# Altium schematic sheet Bluetooth.SchDoc
size A4; SheetNumber: 6; SheetTotal: 10
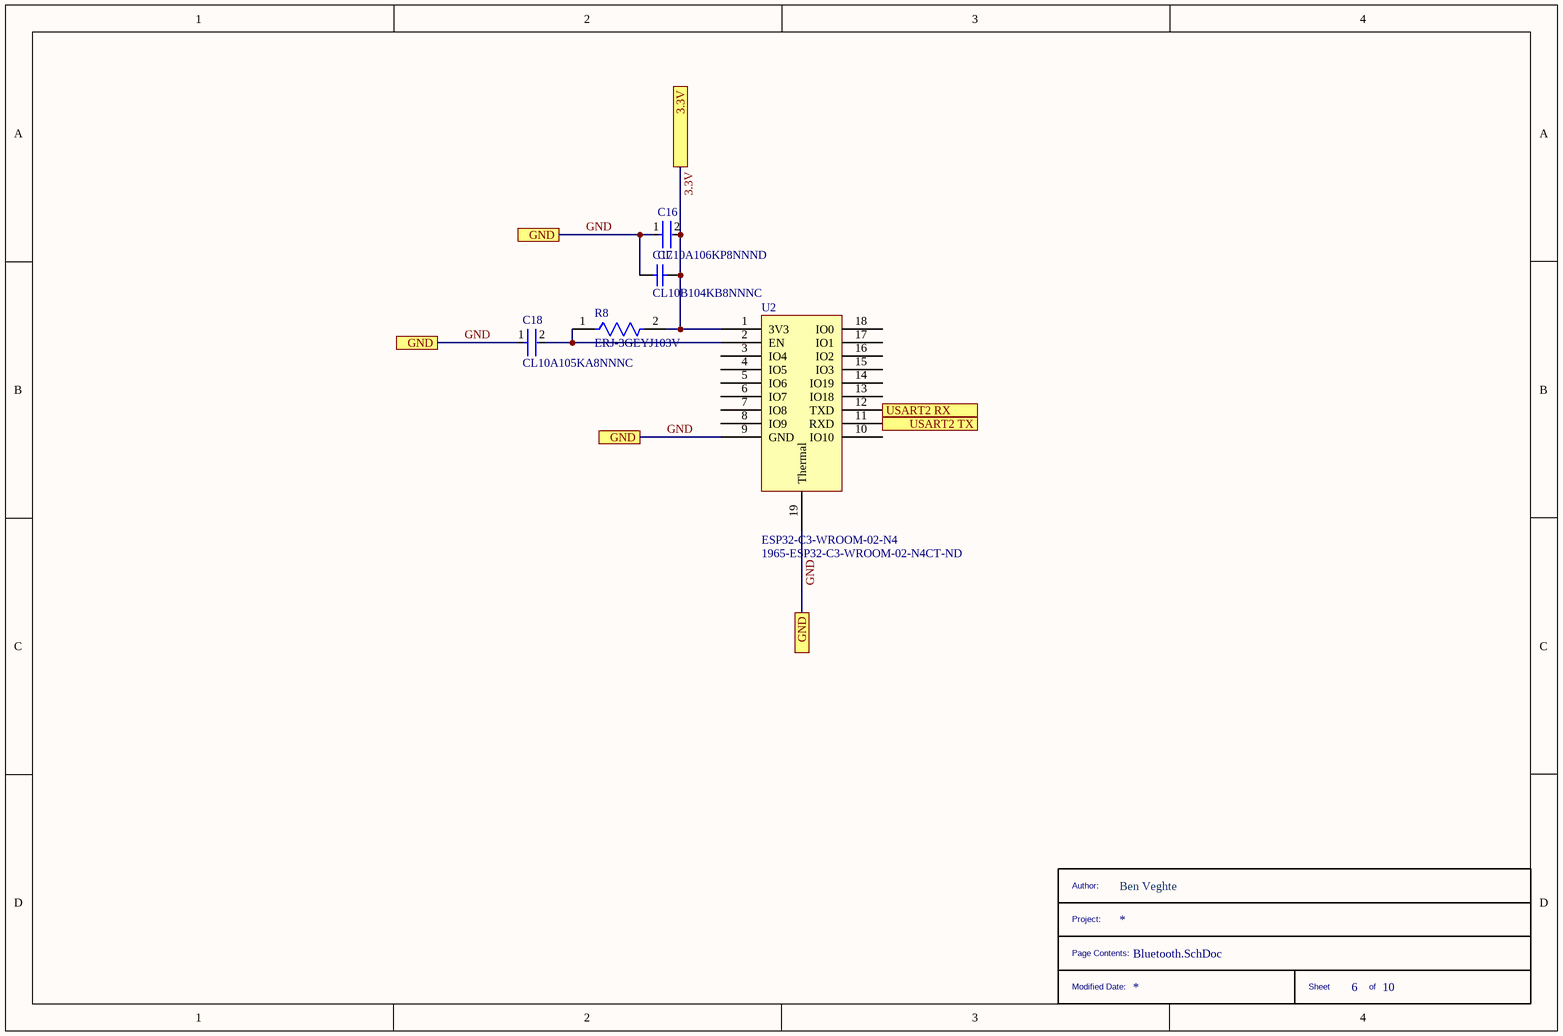
[diagram p0: Bluetooth.SchDoc]

## Parts
*  __TITLE_BLOCK__  (value not drawn)  (graphical)
C16  CL10A106KP8NNND  [FP-CL10-IPC_B]
C17  CL10B104KB8NNNC  [SAMS-C0603-2_M]
C18  CL10A105KA8NNNC  [FP-CL10-IPC_C]
R8  ERJ-3GEYJ103V  [FP-ERJ3G-IPC_C]
U2  ESP32-C3-WROOM-02-N4  Supplier Part Number 1: 1965-ESP32-C3-WROOM-02-N4CT-ND  [ESP32-C3-WROOM-02-N4]

## Ports
3.3V, GND, USART2 RX, USART2 TX

## Nets
3.3V: C16.2 C17.2 R8.2 U2.1(3V3) ; port 3.3V
GND: C16.1 C17.1 C18.1 U2.9(GND) U2.19(Thermal) ; port GND
USART2 RX: U2.12(TXD) ; port USART2 RX
USART2 TX: U2.11(RXD) ; port USART2 TX
NetC18_2: C18.2 R8.1 U2.2(EN)

Not connected (* = marked no-connect by the designer): U2 3(IO4) 4(IO5) 5(IO6) 6(IO7) 7(IO8) 8(IO9) 10(IO10) 13(IO18) 14(IO19) 15(IO3) 16(IO2) 17(IO1) 18(IO0)

## Notes on the sheet
- (in symbol __TITLE_BLOCK__) Author:; Ben Veghte; Project:; Page Contents:; Modified Date:; Sheet; of

## Library data of the parts
C16 = CMP-13271-003245-1: Cap Ceramic 10uF 10V X5R ±10% Pad SMD 0603 +85°C T/R; Packaging: Tape and Reel; Dielectric: X5R; Min Operating Temperature: -55°C; Lead Free: Lead Free; Height: 0.8mm; Package Quantity: 10000; Voltage Rating (DC): 10V; Mount: Surface Mount; Tolerance: 10%; Width: 0.031inch; Thickness: 0.035inch; Depth: 0.8mm; Max Operating Temperature: 85°C; Capacitance: 10uF; Case/Package: 0603; Length: 1.6mm; Voltage Rating: 10V; Radiation Hardening: No
C17 = CMP-2000-05332-1: Multi-layer Ceramic Capacitor, -55 to 125 degC, 2-Pin SMD (0603), RoHS, Tape and Reel; Manufacturer: Samsung Electro-Mechanics; Capacitance: 0.1µF; Rated Voltage: 50V; Dielectric: X7R; Tolerance (%): ±10%; Case Size/Dimension: 0603; Datasheet URL: https://datasheet.ciiva.com/29198/456651-da-01-en-vs-kondensator-0605-29198839.pdf; Manufacturer URL: http://www.samsungsem.com/global/index.jsp; Datasheet Version: Nov-10
C18 = CMP-13271-004127-1: Cap Ceramic 1uF 25V X5R ±10% Pad SMD 0603 +85°C T/R; Height: 0.8mm; Capacitance: 1uF; Depth: 0.8mm; Package Quantity: 1; Mount: Surface Mount; Contact Plating: Tin; Voltage Rating: 25V; Dielectric: X5R; Packaging: Tape and Reel; Material: Ceramic; Case Code (Metric): 1608; Length: 1.6mm; Voltage: 25V; Min Operating Temperature: -55°C; Width: 0.031inch; Tolerance: 10%; Case/Package: 0603; Radiation Hardening: No; Case Code (Imperial): 0603; Thickness: 0.035inch; Lead Free: Lead Free; Max Operating Temperature: 85°C; Voltage Rating (DC): 25V
R8 = CMP-2000-00704-2: RES SMD 10K OHM 5% 1/10W 0603; Temperature Coefficient: 200ppm/°C; Max Power Dissipation: 100mW; Resistance: 10kR; Voltage Rating (DC): 50V; Voltage Rating: 75V; Resistor Type: Thick Film; Tolerance: 5%; Military Standard: Not; Package Quantity: 1; Max Operating Temperature: 155°C; Mount: Surface Mount; Technology: THICK FILM; Case/Package: 0603; Construction: Rectangular; Depth: 0.8mm; Case Code (Imperial): 0603; Weight: 7.1E-05oz; Features: Automotive AEC-Q200; Packaging: Tape and Reel; Width: 0.8mm; Length: 1.6mm; Termination: SMD/SMT; Power Rating: 100mW; Lead Free: Lead Free; Number of Terminations: 2; Height: 0.45mm; RoHS Compliant: Yes; Min Operating Temperature: -55°C; Contact Plating: Tin; REACH SVHC: No SVHC; Resistance Tolerance: 5%; Series: ERJ; Working Voltage: 75V; Case Code (Metric): 1608
U2 = ESP32-C3-WROOM-02-N4: Manufacturer: Espressif Systems; Supplier 1: Digi-Key; Manufacturer Part Number: ESP32-C3-WROOM-02-N4; RoHS: No; Stock 1: 225; Pricing 1: 1=1.95000 (USD)